# EAGLE design MTL_BaroTact1D_V3 (EAGLE 9.6.2)
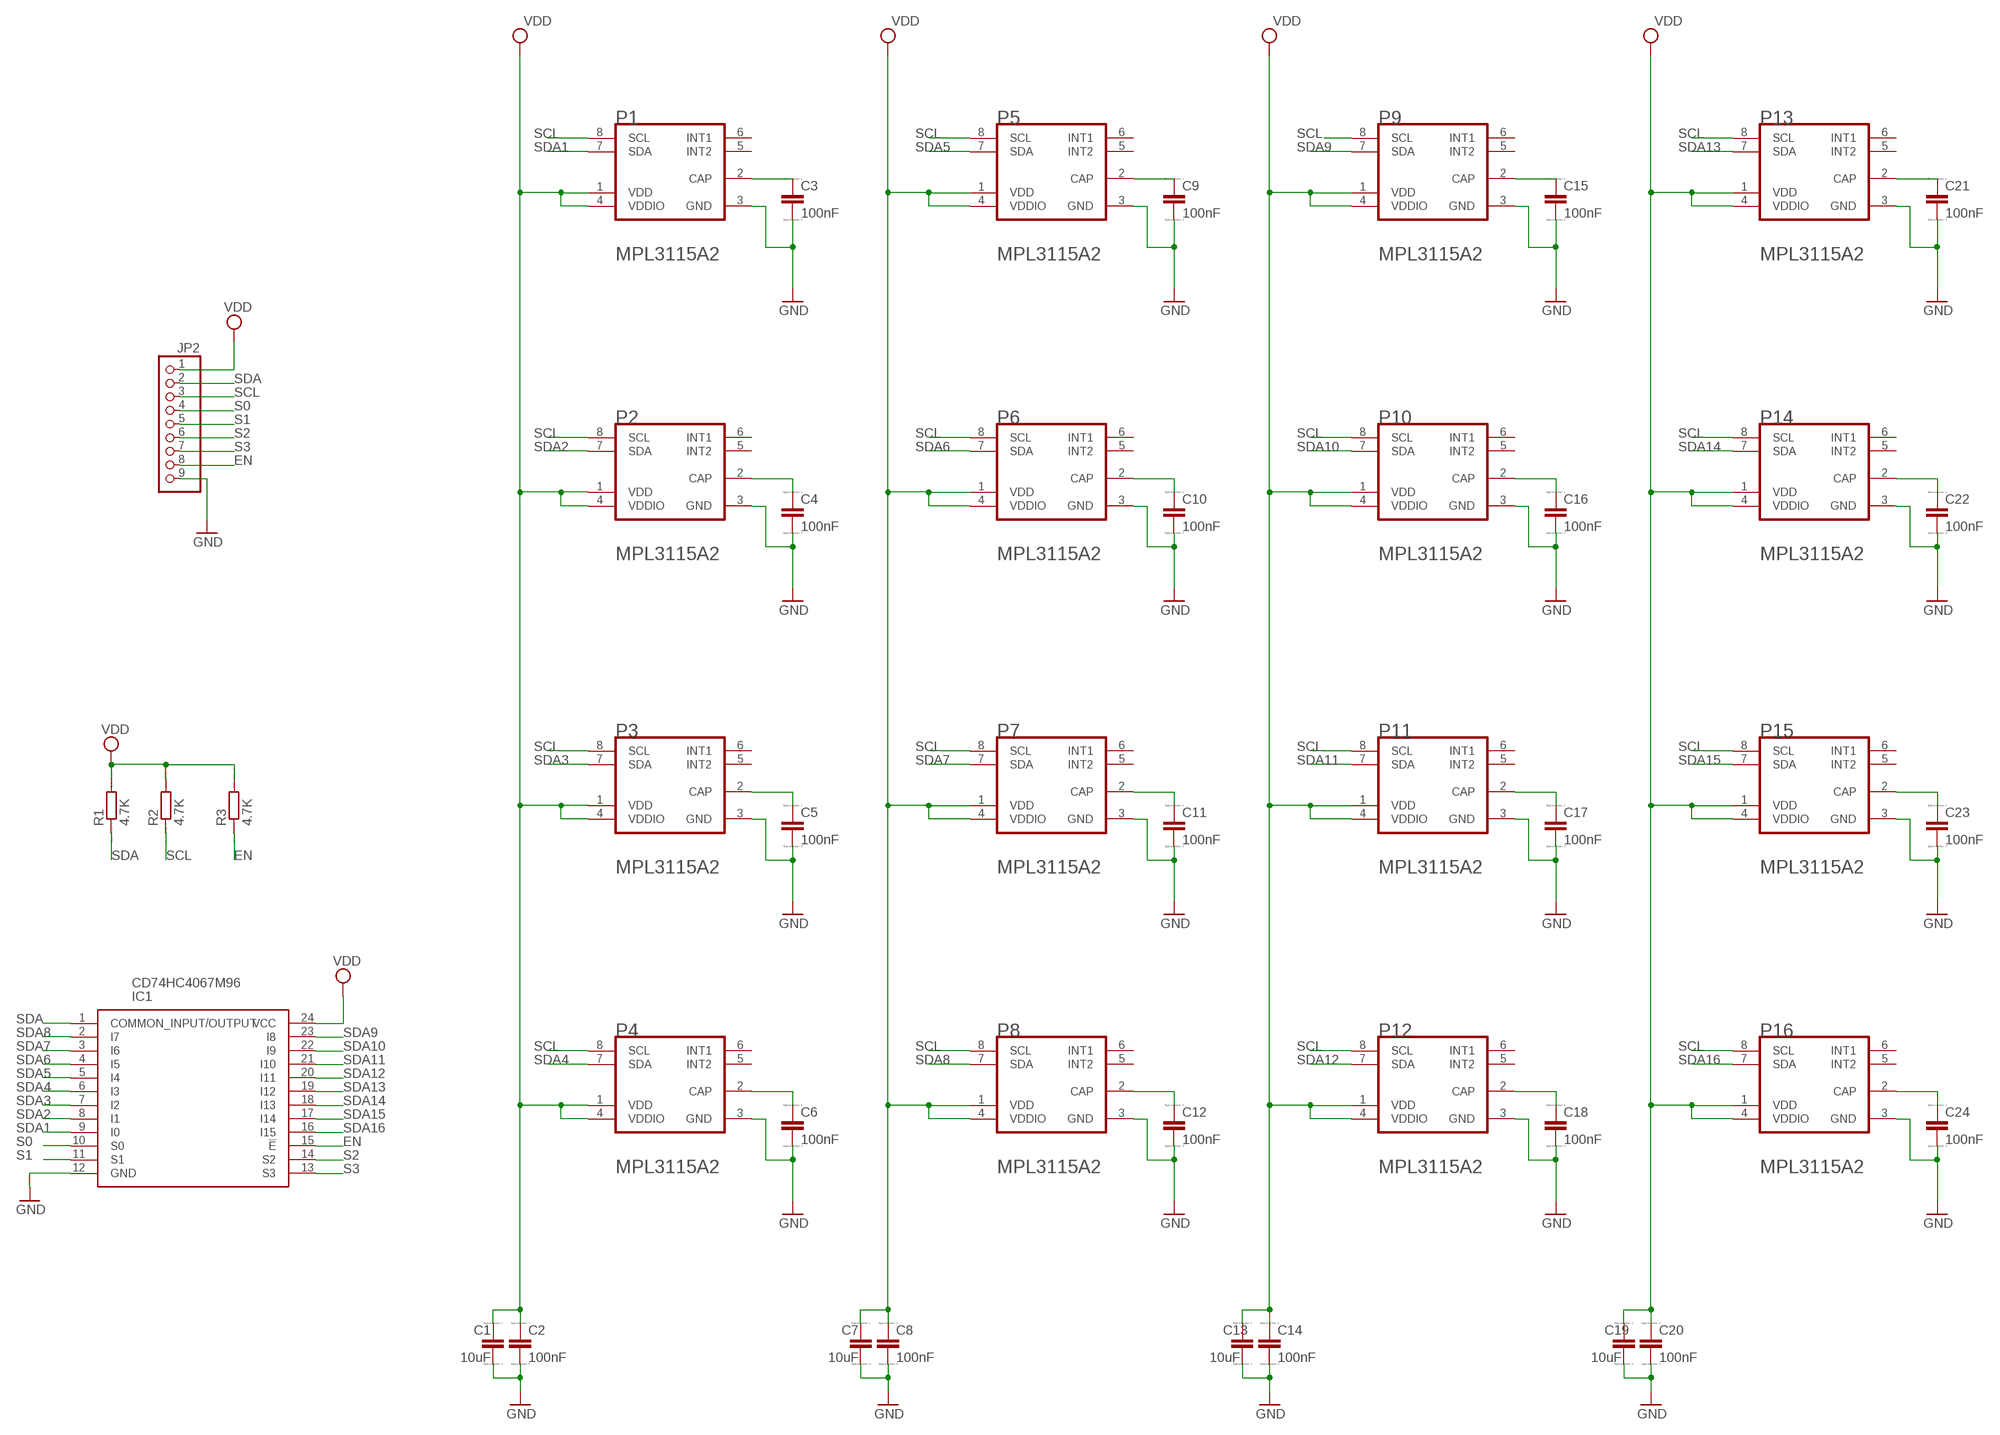
[diagram p0: schematic, sheet 1]

## Parts
C1  10uF  CC0603  [C0603]
C2  100nF  CC0603  [C0603]
C3  100nF  CC0603  [C0603]
C4  100nF  CC0603  [C0603]
C5  100nF  CC0603  [C0603]
C6  100nF  CC0603  [C0603]
C7  10uF  CC0603  [C0603]
C8  100nF  CC0603  [C0603]
C9  100nF  CC0603  [C0603]
C10  100nF  CC0603  [C0603]
C11  100nF  CC0603  [C0603]
C12  100nF  CC0603  [C0603]
C13  10uF  CC0603  [C0603]
C14  100nF  CC0603  [C0603]
C15  100nF  CC0603  [C0603]
C16  100nF  CC0603  [C0603]
C17  100nF  CC0603  [C0603]
C18  100nF  CC0603  [C0603]
C19  10uF  CC0603  [C0603]
C20  100nF  CC0603  [C0603]
C21  100nF  CC0603  [C0603]
C22  100nF  CC0603  [C0603]
C23  100nF  CC0603  [C0603]
C24  100nF  CC0603  [C0603]
IC1  CD74HC4067M96  [SOIC127P1030X265-24N]
JP2  PINHD-1X9  [1X09]
P1  FREESCALE_SEMICONDUCTOR_MPL3115A2FREESCALE_SEMICONDUCTOR_MPL3115A2_0_0  [FREESCALE_SEMICONDUCTOR_MPL3115A2_0]
P2  FREESCALE_SEMICONDUCTOR_MPL3115A2FREESCALE_SEMICONDUCTOR_MPL3115A2_0_0  [FREESCALE_SEMICONDUCTOR_MPL3115A2_0]
P3  FREESCALE_SEMICONDUCTOR_MPL3115A2FREESCALE_SEMICONDUCTOR_MPL3115A2_0_0  [FREESCALE_SEMICONDUCTOR_MPL3115A2_0]
P4  FREESCALE_SEMICONDUCTOR_MPL3115A2FREESCALE_SEMICONDUCTOR_MPL3115A2_0_0  [FREESCALE_SEMICONDUCTOR_MPL3115A2_0]
P5  FREESCALE_SEMICONDUCTOR_MPL3115A2FREESCALE_SEMICONDUCTOR_MPL3115A2_0_0  [FREESCALE_SEMICONDUCTOR_MPL3115A2_0]
P6  FREESCALE_SEMICONDUCTOR_MPL3115A2FREESCALE_SEMICONDUCTOR_MPL3115A2_0_0  [FREESCALE_SEMICONDUCTOR_MPL3115A2_0]
P7  FREESCALE_SEMICONDUCTOR_MPL3115A2FREESCALE_SEMICONDUCTOR_MPL3115A2_0_0  [FREESCALE_SEMICONDUCTOR_MPL3115A2_0]
P8  FREESCALE_SEMICONDUCTOR_MPL3115A2FREESCALE_SEMICONDUCTOR_MPL3115A2_0_0  [FREESCALE_SEMICONDUCTOR_MPL3115A2_0]
P9  FREESCALE_SEMICONDUCTOR_MPL3115A2FREESCALE_SEMICONDUCTOR_MPL3115A2_0_0  [FREESCALE_SEMICONDUCTOR_MPL3115A2_0]
P10  FREESCALE_SEMICONDUCTOR_MPL3115A2FREESCALE_SEMICONDUCTOR_MPL3115A2_0_0  [FREESCALE_SEMICONDUCTOR_MPL3115A2_0]
P11  FREESCALE_SEMICONDUCTOR_MPL3115A2FREESCALE_SEMICONDUCTOR_MPL3115A2_0_0  [FREESCALE_SEMICONDUCTOR_MPL3115A2_0]
P12  FREESCALE_SEMICONDUCTOR_MPL3115A2FREESCALE_SEMICONDUCTOR_MPL3115A2_0_0  [FREESCALE_SEMICONDUCTOR_MPL3115A2_0]
P13  FREESCALE_SEMICONDUCTOR_MPL3115A2FREESCALE_SEMICONDUCTOR_MPL3115A2_0_0  [FREESCALE_SEMICONDUCTOR_MPL3115A2_0]
P14  FREESCALE_SEMICONDUCTOR_MPL3115A2FREESCALE_SEMICONDUCTOR_MPL3115A2_0_0  [FREESCALE_SEMICONDUCTOR_MPL3115A2_0]
P15  FREESCALE_SEMICONDUCTOR_MPL3115A2FREESCALE_SEMICONDUCTOR_MPL3115A2_0_0  [FREESCALE_SEMICONDUCTOR_MPL3115A2_0]
P16  FREESCALE_SEMICONDUCTOR_MPL3115A2FREESCALE_SEMICONDUCTOR_MPL3115A2_0_0  [FREESCALE_SEMICONDUCTOR_MPL3115A2_0]
R1  4.7K  RR0603  [R0603]
R2  4.7K  RR0603  [R0603]
R3  4.7K  RR0603  [R0603]

## Nets
EN [EN]: IC1.15(!E) JP2.8 R3.1
GND: C1.2 C2.2 C3.2 C4.2 C5.2 C6.2 C7.2 C8.2 C9.2 C10.2 C11.2 C12.2 C13.2 C14.2 C15.2 C16.2 C17.2 C18.2 C19.2 C20.2 C21.2 C22.2 C23.2 C24.2 IC1.12(GND) JP2.9 P1.3(GND) P2.3(GND) P3.3(GND) P4.3(GND) P5.3(GND) P6.3(GND) P7.3(GND) P8.3(GND) P9.3(GND) P10.3(GND) P11.3(GND) P12.3(GND) P13.3(GND) P14.3(GND) P15.3(GND) P16.3(GND)
N$3: C3.1 P1.2(CAP)
N$6: C4.1 P2.2(CAP)
N$7: C9.1 P5.2(CAP)
N$9: C10.1 P6.2(CAP)
N$11: C11.1 P7.2(CAP)
N$13: C12.1 P8.2(CAP)
N$14: C5.1 P3.2(CAP)
N$15: C6.1 P4.2(CAP)
N$21: C15.1 P9.2(CAP)
N$30: C16.1 P10.2(CAP)
N$31: C17.1 P11.2(CAP)
N$32: C18.1 P12.2(CAP)
N$45: C21.1 P13.2(CAP)
N$46: C22.1 P14.2(CAP)
N$47: C23.1 P15.2(CAP)
N$48: C24.1 P16.2(CAP)
S0 [S0]: IC1.10(S0) JP2.4
S1 [S1]: IC1.11(S1) JP2.5
S2 [S2]: IC1.14(S2) JP2.6
S3 [S3]: IC1.13(S3) JP2.7
SCL [SCL]: JP2.3 P1.8(SCL) P2.8(SCL) P3.8(SCL) P4.8(SCL) P5.8(SCL) P6.8(SCL) P7.8(SCL) P8.8(SCL) P9.8(SCL) P10.8(SCL) P11.8(SCL) P12.8(SCL) P13.8(SCL) P14.8(SCL) P15.8(SCL) P16.8(SCL) R2.1
SDA [SDA]: IC1.1(COMMON_INPUT/OUTPUT) JP2.2 R1.1
SDA1: IC1.9(I0) P1.7(SDA)
SDA2: IC1.8(I1) P2.7(SDA)
SDA3: IC1.7(I2) P3.7(SDA)
SDA4: IC1.6(I3) P4.7(SDA)
SDA5: IC1.5(I4) P5.7(SDA)
SDA6: IC1.4(I5) P6.7(SDA)
SDA7: IC1.3(I6) P7.7(SDA)
SDA8: IC1.2(I7) P8.7(SDA)
SDA9: IC1.23(I8) P9.7(SDA)
SDA10: IC1.22(I9) P10.7(SDA)
SDA11: IC1.21(I10) P11.7(SDA)
SDA12: IC1.20(I11) P12.7(SDA)
SDA13: IC1.19(I12) P13.7(SDA)
SDA14: IC1.18(I13) P14.7(SDA)
SDA15: IC1.17(I14) P15.7(SDA)
SDA16: IC1.16(I15) P16.7(SDA)
VDD: C1.1 C2.1 C7.1 C8.1 C13.1 C14.1 C19.1 C20.1 IC1.24(VCC) JP2.1 P1.1(VDD) P1.4(VDDIO) P2.1(VDD) P2.4(VDDIO) P3.1(VDD) P3.4(VDDIO) P4.1(VDD) P4.4(VDDIO) P5.1(VDD) P5.4(VDDIO) P6.1(VDD) P6.4(VDDIO) P7.1(VDD) P7.4(VDDIO) P8.1(VDD) P8.4(VDDIO) P9.1(VDD) P9.4(VDDIO) P10.1(VDD) P10.4(VDDIO) P11.1(VDD) P11.4(VDDIO) P12.1(VDD) P12.4(VDDIO) P13.1(VDD) P13.4(VDDIO) P14.1(VDD) P14.4(VDDIO) P15.1(VDD) P15.4(VDDIO) P16.1(VDD) P16.4(VDDIO) R1.2 R2.2 R3.2
Unconnected: P1.5(INT2) P1.6(INT1) P2.5(INT2) P2.6(INT1) P3.5(INT2) P3.6(INT1) P4.5(INT2) P4.6(INT1) P5.5(INT2) P5.6(INT1) P6.5(INT2) P6.6(INT1) P7.5(INT2) P7.6(INT1) P8.5(INT2) P8.6(INT1) P9.5(INT2) P9.6(INT1) P10.5(INT2) P10.6(INT1) P11.5(INT2) P11.6(INT1) P12.5(INT2) P12.6(INT1) P13.5(INT2) P13.6(INT1) P14.5(INT2) P14.6(INT1) P15.5(INT2) P15.6(INT1) P16.5(INT2) P16.6(INT1)

## Library data of the parts
C1-C24 = eagle-ltspice:C: CAPACITOR, European symbol; SPICEMODEL: NONE; SPICEPREFIX: C
IC1 = CD74HC4067M96:CD74HC4067M96: High Speed CMOS 16-Channel Analog Multiplexer/Demultiplexer Source: Datasheet <http://www.ti.com/lit/gpn/cd74hc4067>; DESCRIPTION: High Speed CMOS 16-Channel Analog Multiplexer/Demultiplexer; HEIGHT: 2.65mm; MANUFACTURER_NAME: Texas Instruments; MANUFACTURER_PART_NUMBER: CD74HC4067M96; MOUSER_PART_NUMBER: 595-CD74HC4067M96; MOUSER_PRICE-STOCK: https://www.mouser.co.uk/ProductDetail/Texas-Instruments/CD74HC4067M96?qs=xFfolx0DHx0XT7d9xTTZBA%3D%3D
JP2 = pinhead:PINHD-1X9: PIN HEADER
P1-P16 = Freescale Semiconductor - MPL3115A2:FREESCALE_SEMICONDUCTOR_MPL3115A2: FRES-MPL3115A2-8; CIIVA_IDS: 1172243; COMPONENT_LINK_1_DESCRIPTION: Manufacturer URL; COMPONENT_LINK_1_URL: http://www.freescale.com/; COMPONENT_LINK_3_DESCRIPTION: Package Specification; COMPONENT_LINK_3_URL: http://cache.freescale.com/files/shared/doc/package_info/98ASA00260D.pdf; DATASHEET: http://cache.freescale.com/files/sensors/doc/data_sheet/MPL3115A2.pdf; DATASHEET_VERSION: Rev. 3.0; FOOTPRINT_VARIANT_NAME_0: Manufacturer Recommended; FSCL20_PF: 4 MHz Max.; FSCL400_PF: 400 KHz Max.; IMPORTED: yes; IMPORTED_FROM: vault; IMPORT_TS: 1521845373; MF: Freescale Semiconductor; MOUNTING_TECHNOLOGY: Surface Mount; MPN: MPL3115A2; OPERATING_TEMPERATURE_RANGE: -40 to 85 degC; PACKAGE_DESCRIPTION: 8-Pin Land Grid Array, Body 5 x 3 mm, Pitch 1.25 mm; PACKAGE_VERSION: Rev. O; PACKING: Tray; PIN_0_0_7_INSIDE_EDGE: clock; PREFIX: U; RELEASE_DATE: 1435138815; ROHS: Yes; VAULT_GUID: C9CA789F-172F-4FBE-A7EA-5C936E43DE32; VAULT_REVISION: 13F1D4E8-B129-4F1C-B772-6A98733F3276; VDD: 1.95 to 3.6 V; VDDIO: 1.62 to 3.6 V
R1-R3 = eagle-ltspice:R: RESISTOR, European symbol; SPICEMODEL: NONE; SPICEPREFIX: R

## Board
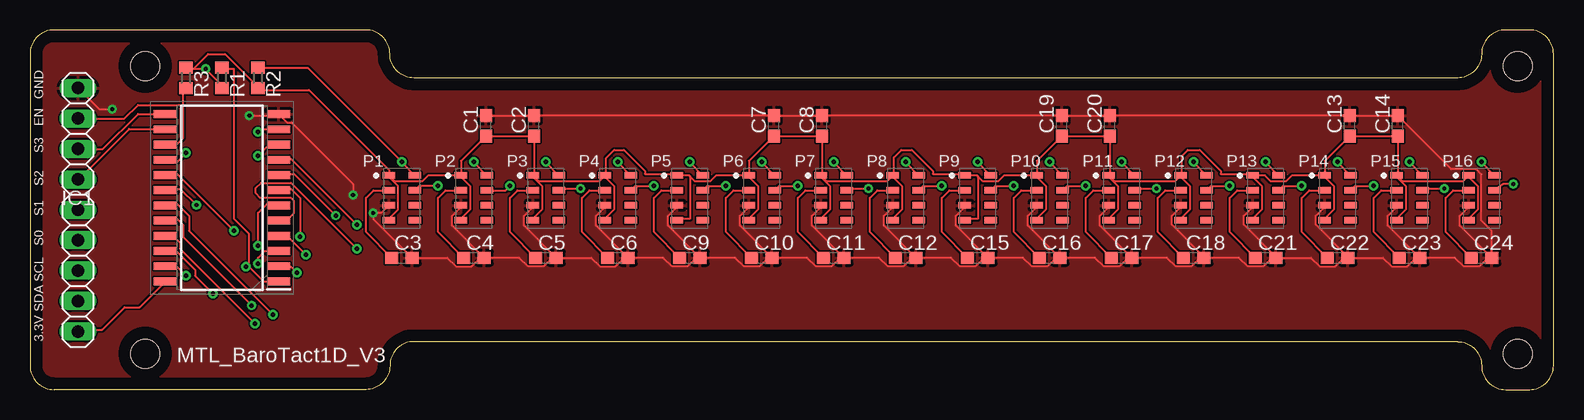
[diagram p1: board, top side]
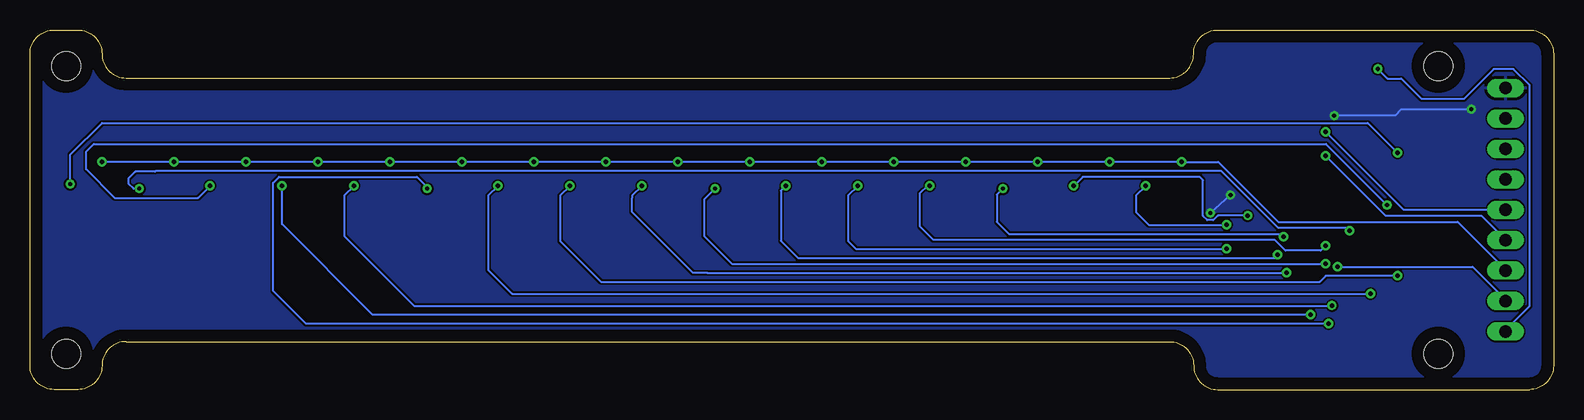
[diagram p2: board, bottom side, seen from below]

Size 127 x 30 mm. Coordinates in mm from the lower left corner, seen from the top.
Outline: 0,28 0,2 arc90 2,0 28,0 arc90 30,2 arc-90 32,4 119,4 arc-90 121,2 arc90 123,0 125,0 arc90 127,2 127,28 arc90 125,30 123,30 arc90 121,28 arc-90 119,26 32,26 arc-90 30,28 arc90 28,30 2,30 arc90 0,28
Copper layers (1*16): Top 0.035mm / dielectric 1.5mm / Bottom 0.035mm
Design rules "default": minimum track width 6mil, minimum drill 0.35mm, track to track 6mil, track to pad 6mil, pad to pad 6mil, via to via 6mil, smd to smd 6mil, copper to edge 40mil, drill to drill 6mil, minimum pad ring 10mil, minimum via ring 8mil, stop-mask expansion 4mil, vias tented up to drill 0mil, thermal gap 10mil
Holes 2.4 mm at 124,27 124,3 9.6,27 9.6,3

### Footprints (pad centres in the part's own frame; a part is rotated, then mirrored left to right if it is on the bottom)
C0603 = smd 1.1 x 1: 1 -0.85,0; 2 0.85,0
SOIC127P1030X265-24N = smd 1.95 x 0.65: 1 -4.725,6.985; 2 -4.725,5.715; 3 -4.725,4.445; 4 -4.725,3.175; 5 -4.725,1.905; 6 -4.725,0.635; 7 -4.725,-0.635; 8 -4.725,-1.905; 9 -4.725,-3.175; 10 -4.725,-4.445; 11 -4.725,-5.715; 12 -4.725,-6.985; 13 4.725,-6.985; 14 4.725,-5.715; 15 4.725,-4.445; 16 4.725,-3.175; 17 4.725,-1.905; 18 4.725,-0.635; 19 4.725,0.635; 20 4.725,1.905; 21 4.725,3.175; 22 4.725,4.445; 23 4.725,5.715; 24 4.725,6.985
1X09 = drill 1.016 long: 1 -10.16,0; 2 -7.62,0; 3 -5.08,0; 4 -2.54,0; 5 0,0; 6 2.54,0; 7 5.08,0; 8 7.62,0; 9 10.16,0
FREESCALE_SEMICONDUCTOR_MPL3115A2_0 = smd 1.05 x 0.55: 1 -1.075,1.875; 2 -1.075,0.625; 3 -1.075,-0.625; 4 -1.075,-1.875; 5 1.075,-1.875; 6 1.075,-0.625; 7 1.075,0.625; 8 1.075,1.875
R0603 = smd 1 x 1.1: 1 -0.85,0; 2 0.85,0

### Placement (x,y rotation side)
C1  38,22 90 top
C2  42,22 90 top
C3  31,11 0 top
C4  37,11 0 top
C5  43,11 0 top
C6  49,11 0 top
C7  62,22 90 top
C8  66,22 90 top
C9  55,11 0 top
C10  61,11 0 top
C11  67,11 0 top
C12  73,11 0 top
C13  110,22 90 top
C14  114,22 90 top
C15  79,11 0 top
C16  85,11 0 top
C17  91,11 0 top
C18  97,11 0 top
C19  86,22 90 top
C20  90,22 90 top
C21  103,11 0 top
C22  109,11 0 top
C23  115,11 0 top
C24  121,11 0 top
IC1  16,16 180 top
JP2  4,15 90 top
P1  31,16 0 top
P2  37,16 0 top
P3  43,16 0 top
P4  49,16 0 top
P5  55,16 0 top
P6  61,16 0 top
P7  67,16 0 top
P8  73,16 0 top
P9  79,16 0 top
P10  85,16 0 top
P11  91,16 0 top
P12  97,16 0 top
P13  103,16 0 top
P14  109,16 0 top
P15  115,16 0 top
P16  121,16 0 top
R1  16,26 270 top
R2  19,26 270 top
R3  13,26 90 top

### Tracks (layer width: path | path; a pad name or v marks a point on that pad's centre or on a via)
EN
  Top 0.152: 12.75,23.75 12.75,23 12.75,21 12.25,20.5 11.5,20.5 IC1.15 | 12.75,23.75 12.75,24.75 13,25 R3.1 | 12.4,23.75 9,23.75 7.87,22.62 JP2.8 | 12.4,23.75 12.75,23.75 | 12.4,23.75
GND  (via drill 0.35)
  Top 0.152: C1.2 C2.2 C7.2 C8.2 C19.2 C20.2 C13.2 C14.2 118.47,18.38 120.55,18.38 120.98,17.94 120.98,14.09 121.85,13.23 C24.2 | P1.3 29.28,14.73 v28.61,14.73 28.61,14.24 C3.2 34.78,11 35.51,10.27 36.8,10.27 37.52,11 C4.2 | JP2.9 5.78,23.38 v6.86,23.38 | v18.29,22.86 20.6,22.86 IC1.12 21.44,22.27 21.8,22.27 26.92,17.14 v26.92,16.22 | P2.3 35.92,15.25 35.17,14.49 35.17,13.68 C4.2 | P3.3 41.92,15.25 41.17,14.49 41.17,13.68 C5.2 | C5.2 46.78,11 47.51,10.27 48.8,10.27 49.52,11 C6.2 | C24.2 121.52,11 120.8,10.27 119.5,10.27 118.78,11 C23.2 | P15.3 113.92,15.25 113.17,14.49 113.17,13.68 C23.2 | P16.3 119.92,15.25 119.17,14.49 119.17,13.68 C24.2 | P14.3 107.92,15.25 107.17,14.49 107.17,13.76 109.85,11.08 C22.2 | C22.2 112.78,11 113.5,10.27 114.8,10.27 115.52,11 C23.2 | P13.3 101.92,15.25 101.17,14.49 101.17,13.76 103.85,11.08 C21.2 | C21.2 103.52,11 102.8,10.27 101.5,10.27 100.78,11 C18.2 | P12.3 95.92,15.25 95.17,14.49 95.17,13.76 97.85,11.08 C18.2 | C18.2 97.52,11 96.8,10.27 95.5,10.27 94.78,11 C17.2 | P11.3 89.92,15.25 89.17,14.49 89.17,13.68 C17.2 | C17.2 91.52,11 90.8,10.27 89.5,10.27 88.78,11 C16.2 | P10.3 83.92,15.25 83.17,14.49 83.17,13.68 C16.2 | C16.2 85.52,11 84.8,10.27 83.5,10.27 82.78,11 C15.2 | P9.3 77.92,15.25 77.17,14.49 77.17,13.68 C15.2 | C15.2 79.52,11 78.8,10.27 77.5,10.27 76.78,11 C12.2 | P8.3 71.92,15.25 71.17,14.49 71.17,13.68 C12.2 | C12.2 73.52,11 72.8,10.27 71.5,10.27 70.78,11 C11.2 | C11.2 67.52,11 66.8,10.27 65.5,10.27 64.78,11 C10.2 | P7.3 65.92,15.25 65.17,14.49 65.17,13.68 C11.2 | P6.3 59.92,15.25 59.17,14.49 59.17,13.68 C10.2 | C10.2 61.52,11 60.8,10.27 59.51,10.27 58.78,11 C9.2
  Top 0.152: P5.3 53.92,15.25 53.17,14.49 53.17,13.68 C9.2 | C9.2 55.52,11 54.8,10.27 53.51,10.27 52.78,11 C6.2 | P4.3 47.92,15.25 47.17,14.49 47.17,13.68 C6.2 | C21.2 106.78,11 107.5,10.27 108.8,10.27 109.52,11 C22.2 | C5.2 43.52,11 42.8,10.27 41.51,10.27 40.78,11 C4.2
  Bottom 0.152: v28.61,14.73 v26.92,16.22 | v18.29,22.86 13.21,22.86 12.68,23.38 v6.86,23.38
  pour Top: 0,2 2,0 28,0 30,2 30,4 121,4 121,2 123,0 125,0 127,2 127,28 125,30 123,30 121,28 121,26 30,26 30,28 28,30 2,30 0,28
  pour Bottom: 0,2 2,0 28,0 30,2 30,4 121,4 121,2 123,0 125,0 127,2 127,28 125,30 123,30 121,28 121,26 30,26 30,28 28,30 2,30 0,28
N$3
  Top 0.152: C3.1 28,13.15 28,16 28.62,16.62 P1.2
N$6
  Top 0.152: C4.1 34,13.15 34,16 34.62,16.62 P2.2
N$7
  Top 0.152: C9.1 52,13.15 52,16 52.62,16.62 P5.2
N$9
  Top 0.152: C10.1 58,13.15 58,16 58.62,16.62 P6.2
N$11
  Top 0.152: C11.1 64,13.15 64,16 64.62,16.62 P7.2
N$13
  Top 0.152: C12.1 70,13.15 70,16 70.62,16.62 P8.2
N$14
  Top 0.152: C5.1 40,13.15 40,16 40.62,16.62 P3.2
N$15
  Top 0.152: C6.1 46,13.15 46,16 46.62,16.62 P4.2
N$21
  Top 0.152: C15.1 76,13.15 76,16 76.62,16.62 P9.2
N$30
  Top 0.152: C16.1 82,13.15 82,16 82.62,16.62 P10.2
N$31
  Top 0.152: C17.1 88,13.15 88,16 88.62,16.62 P11.2
N$32
  Top 0.152: C18.1 94,13.15 94,16 94.62,16.62 P12.2
N$45
  Top 0.152: C21.1 100,13.15 100,16 100.62,16.62 P13.2
N$46
  Top 0.152: C22.1 106,13.15 106,16 106.62,16.62 P14.2
N$47
  Top 0.152: C23.1 112,13.15 112,16 112.62,16.62 P15.2
N$48
  Top 0.152: C24.1 118,13.15 118,16 118.62,16.62 P16.2
S0  (via drill 0.35)
  Top 0.152: v19,19.5 19.95,20.45 IC1.10
  Bottom 0.152: v19,19.5 14,14.5 6,14.5 4,12.5 JP2.4
S1  (via drill 0.35)
  Top 0.152: v19,21.5 19.21,21.71 IC1.11
  Bottom 0.152: v19,21.5 12.5,15 JP2.5
S2
  Top 0.152: IC1.14 11.25,21.75 8.25,21.75 4,17.5 JP2.6
S3
  Top 0.152: IC1.13 11.25,23 9,23 6.08,20.08 JP2.7
SCL  (via drill 0.35)
  Top 0.152: P16.8 121,18.95 v121,19 | P15.8 115,18.95 v115,19 | P14.8 109,18.95 v109,19 | P13.8 103,18.95 v103,19 | P12.8 97,18.95 v97,19 | P11.8 91,18.95 v91,19 | P10.8 85,18.95 v85,19 | P9.8 79,18.95 v79,19 | P8.8 73,18.95 v73,19 | P7.8 67,18.95 v67,19 | P6.8 61,18.95 v61,19 | P5.8 55,18.95 v55,19 | P4.8 49,18.95 v49,19 | P3.8 43,18.95 v43,19 | P2.8 37,18.95 v37,19 | P1.8 31,18.95 v31,19 23.15,26.85 R2.1
  Bottom 0.152: v121,19 v115,19 v109,19 v103,19 v97,19 v91,19 v85,19 v79,19 v73,19 v67,19 v61,19 v55,19 v49,19 v43,19 v37,19 v31,19 27.95,19 22.95,14 8,14 4,10 JP2.3
SDA  (via drill 0.35)
  Top 0.152: 18.25,10.25 18.25,13 17,14.25 17,26.75 16,26.75 R1.1 | 18.25,10.25 19.5,9 20.5,9 IC1.1 | 18.25,10.25 v18,10.25
  Bottom 0.152: v18,10.25 6.75,10.25 4,7.5 JP2.2
SDA1  (via drill 0.35)
  Top 0.152: v27.25,13.75 21.75,19.25 20.75,19.25 IC1.9 | v34,17 32.45,17 P1.7
  Bottom 0.152: v34,17 34.8,16.2 34.8,14.8 33.75,13.75 v27.25,13.75
SDA2  (via drill 0.35)
  Top 0.152: P2.7 39.62,16.62 v40,17 | IC1.8 20.75,18 22,18 v25.49,14.51
  Bottom 0.152: v40,17 39.25,17.75 29.5,17.75 29.21,17.46 29.21,14.48 28.86,14.12 28.36,14.12 27.97,14.51 v25.49,14.51
SDA3  (via drill 0.35)
  Top 0.152: P3.7 44.21,16.76 v45.9,16.76 | v22.5,12.75 22.5,16 21.75,16.75 20.75,16.75 IC1.7
  Bottom 0.152: v22.5,12.75 22.75,13 45.4,13 46.4,14 46.4,16.26 v45.9,16.76
SDA4  (via drill 0.35)
  Top 0.152: P4.7 50.45,17 v52,17 | IC1.6 20.5,15.5 19.75,15.5 19,14.75 v19,12
  Bottom 0.152: v52,17 52.2,17 52.8,16.4 52.8,13.6 51.7,12.5 23.25,12.5 22.77,12.03 22.75,12 22.35,11.6 19.4,11.6 v19,12
SDA5  (via drill 0.35)
  Top 0.152: P5.7 56.45,17 v58,17 | v27.25,11.75 21.75,17.25 19.25,17.25 18.8,16.8 18.8,16.4 19.2,16 21.75,16 22,15.75 22,14.75 21.5,14.25 20.75,14.25 IC1.5
  Bottom 0.152: v58,17 58.8,16.2 58.8,12.4 58.15,11.75 v27.25,11.75
SDA6  (via drill 0.35)
  Top 0.152: P6.7 62.45,17 v64,17 | v23,11.25 21.5,12.75 20.75,12.75 IC1.4
  Bottom 0.152: v23,11.25 23.25,11 63,11 64.4,12.4 64.4,16.6 v64,17
SDA7  (via drill 0.35)
  Top 0.152: P7.7 68.21,16.76 v69.9,16.76 | IC1.3 20.5,11.55 20.05,11.55 19.56,11.55 19,11 v19,10.5
  Bottom 0.152: v69.9,16.76 70.8,15.86 70.8,12.8 68.5,10.5 v19,10.5
SDA8  (via drill 0.35)
  Top 0.152: P8.7 74.45,17 v76,17 | v22.25,9.75 21.75,10.25 20.75,10.25 IC1.2
  Bottom 0.152: v76,17 76.8,16.2 76.8,16 76.8,14.8 71.75,9.75 70.55,9.75 v22.25,9.75
SDA9  (via drill 0.35)
  Top 0.152: P9.7 80.45,17 v82,17 | v13,9.5 12.25,10.25 11.5,10.25 IC1.23
  Bottom 0.152: v13,9.5 19,9.5 19.5,9 79.4,9 82.8,12.4 82.8,16.2 v82,17
SDA10  (via drill 0.35)
  Top 0.152: P10.7 86.45,17 v88,17 | v15.25,8 13.75,9.5 13.75,10 12.25,11.5 11.5,11.5 IC1.22
  Bottom 0.152: v88,17 88.8,16.2 88.8,10 86.8,8 v15.25,8
SDA11  (via drill 0.35)
  Top 0.152: P11.7 92.21,16.76 v93.9,16.76 | v18.75,5.5 12.5,11.75 12.5,12.25 12,12.75 11.5,12.75 IC1.21
  Bottom 0.152: v18.75,5.5 104,5.5 106.75,8.25 106.75,17.25 106.25,17.75 94.75,17.75 94,17 v93.9,16.76
SDA12  (via drill 0.35)
  Top 0.152: P12.7 98.45,17 v100,17 | v18.47,7.01 12.75,12.72 12.75,13.75 12.25,14.25 11.5,14.25 IC1.20
  Bottom 0.152: v18.47,7.01 v18.48,7 95,7 100.8,12.8 100.8,16.2 v100,17
SDA13  (via drill 0.35)
  Top 0.152: P13.7 104.45,17 v106,17 | v20.25,6.25 13.25,13.25 13.25,14.5 12.25,15.5 11.5,15.5 IC1.19
  Bottom 0.152: v106,17 106,13.8 98.44,6.25 v20.25,6.25
SDA14  (via drill 0.35)
  Top 0.152: P14.7 110.45,17 v112,17 | v13.88,15.4 12.53,16.75 11.5,16.75 IC1.18
  Bottom 0.152: v112,17 113,16 119.94,16 122.33,18.39 122.33,19.84 121.67,20.5 18.98,20.5 v13.88,15.4
SDA15  (via drill 0.35)
  Top 0.152: P15.7 116.21,16.76 v117.9,16.76 | v17,13.25 12.25,18 11.5,18 IC1.17
  Bottom 0.152: v17,13.25 17.25,13.5 22.95,13.5 27.7,18.25 116.5,18.25 116.58,18.18 118.22,18.18 118.8,17.6 118.8,17.2 118.36,16.76 v117.9,16.76
SDA16  (via drill 0.35)
  Top 0.152: v123.65,17.15 122.81,17.15 P16.7 | v13,19.75 12.25,19 11.5,19 IC1.16
  Bottom 0.152: v123.65,17.15 123.65,19.6 121,22.25 15.5,22.25 v13,19.75
VDD  (via drill 0.35)
  Top 0.152: P2.1 35.92,19.07 C1.1 C2.1 42,17.95 P3.1 | P2.1 35.92,17.75 36.68,17 36.68,15.01 35.92,14.25 P2.4 | P3.1 41.92,17.75 42.68,17 42.68,15.01 41.92,14.25 P3.4 | P2.1 33.2,17.88 32.7,17.37 30.43,17.37 P1.1 | P3.1 42.43,17.37 47.42,17.37 P4.1 | P4.1 47.92,17.75 48.68,17 48.68,15.01 47.92,14.25 P4.4 | P6.1 59.92,19.07 C7.1 C8.1 66,17.95 P7.1 | P6.1 59.92,17.75 60.68,17 60.68,15.01 59.92,14.25 P6.4 | P6.1 57.2,17.88 56.7,17.37 55.45,17.37 55.04,17.79 | 55.04,17.79 54.95,17.88 P5.1 53.75,18 51.25,18 51.25,18.25 49.5,20 48.7,20 48,19.3 48,18 P4.1 | P7.1 66.43,17.37 71.42,17.37 P8.1 | P7.1 65.92,17.75 66.68,17 66.68,15.01 65.92,14.25 P7.4 | P8.1 71.92,17.75 72.68,17 72.68,15.01 71.92,14.25 P8.4 | P10.1 83.92,19.07 C19.1 C20.1 90,17.95 P11.1 | P10.1 81.2,17.88 80.69,17.37 79.45,17.37 79.04,17.79 | 79.04,17.79 78.95,17.88 P9.1 77.75,18 75.25,18 75.25,18.25 73.5,20 72.64,20 72,19.36 72,18 P8.1 | P10.1 83.92,17.75 84.68,17 84.68,15.01 83.92,14.25 P10.4 | P11.1 89.92,17.75 90.68,17 90.68,15.01 89.92,14.25 P11.4 | P12.1 95.42,17.37 90.43,17.37 P11.1 | P12.1 95.92,17.75 96.68,17 96.68,15.01 95.92,14.25 P12.4 | P14.1 107.92,19.07 C13.1 C14.1 114,17.95 P15.1 | P15.1 113.92,17.75 114.68,17 114.68,15.01 113.92,14.25 P15.4 | P14.1 107.92,17.75 108.68,17 108.68,15.01 107.92,14.25 P14.4 | P14.1 105.2,17.88 104.69,17.37 103.45,17.37 102.95,17.88 P13.1 | P13.1 101.92,17.75 102.68,17 102.68,15.01 101.92,14.25 P13.4 | P16.4 119.92,14.25 120.68,15.01 120.68,17 119.92,17.75 P16.1 119.42,17.37 114.43,17.37 P15.1 | IC1.24 11.25,9 9.12,6.88 7.88,6.88 6,5 4,5 JP2.1 | 13.6,26.75 v14.65,26.75 16.15,25.25 16,25.25 R1.2
  Top 0.152: 13.6,26.75 13,26.75 R3.2 | P9.4 78,14.25 79,14.25 79,17.75 79.04,17.79 | P5.4 54,14.25 55,14.25 55,17.75 55.04,17.79 | P13.1 101.75,18 99.25,18 99.25,18.25 97.5,20 96.52,20 96,19.48 96,18 P12.1 | P1.4 29.93,14.25 30.68,15.01 30.68,17 29.93,17.75 P1.1 | P1.1 29.93,18.32 23.25,25 19,25 R2.2 19,25.25 16.25,28 14.85,28 13.6,26.75
  Bottom 0.152: JP2.1 4,5 2,7 2,25.4 3.35,26.75 4.98,26.75 7.49,24.24 11,24.24 12.71,25.95 13.85,25.95 v14.65,26.75

### Text on the board
tNames: GND | EN | S3 | S2 | S1 | S0 | SCL | SDA | 3.3V | MTL_BaroTact1D_V3
Measures: Unit: mm / Thickness: 1.6 mm